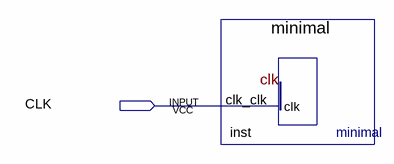
[diagram p0: schematic sheet]
// Quartus schematic proj_nios2e.bdf as structural Verilog: 1 symbols, 1 pins
module proj_nios2e (
  input  CLK
);

  minimal inst (.clk_clk(CLK));
endmodule
